# EAGLE schematic opencmpp (EAGLE 6.4)
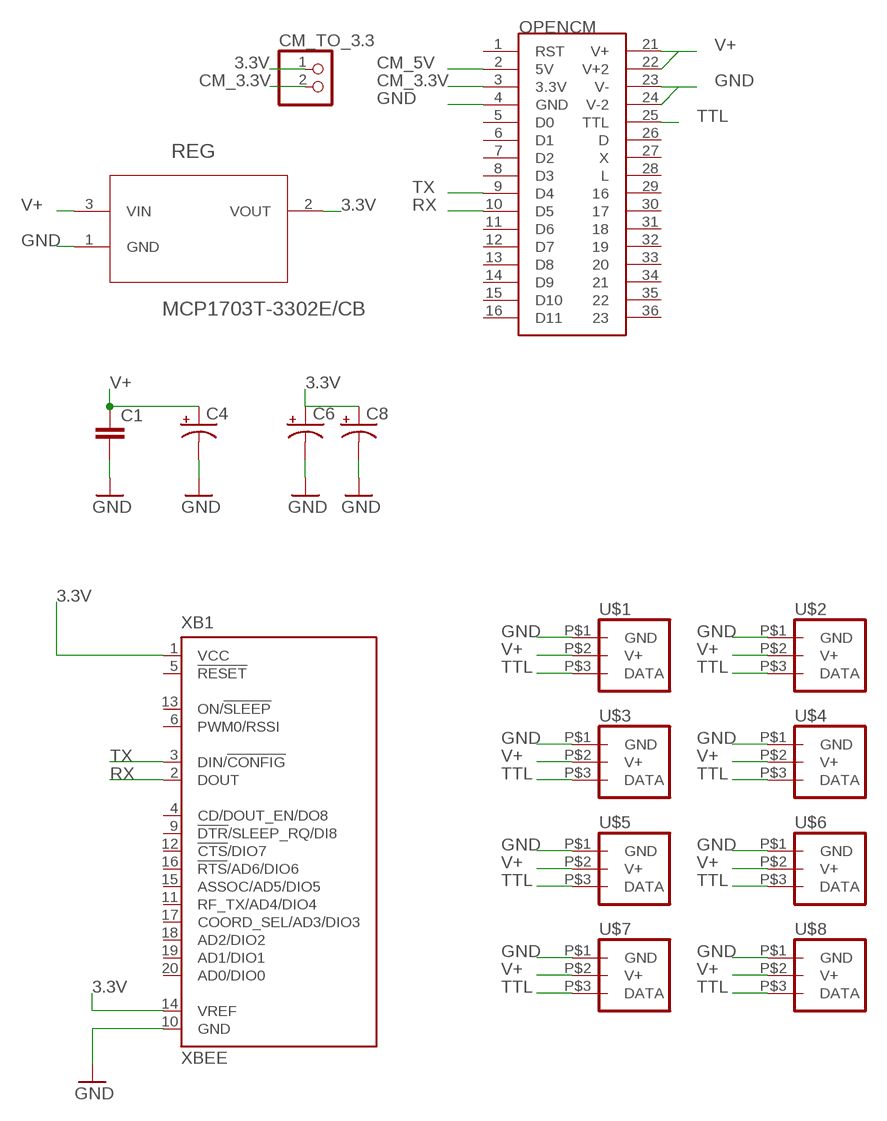
[diagram p0: schematic, sheet 1]

## Parts
C1  C-EU075-032X103  [C075-032X103]
C4  CAP_POLPTH2  [CPOL-RADIAL-10UF-25V]
C6  CAP_POLPTH2  [CPOL-RADIAL-10UF-25V]
C8  CAP_POLPTH2  [CPOL-RADIAL-10UF-25V]
CM_TO_3.3  CONNEC_1X02  [CONNEC_1X02]
OPENCM  OPENCM_REDUC  [OPENCM_REDUC]
REG  MCP1703T-3302E/CB  [SOT95P300X145-3N]
U$1  XL_320_CONNEC  [DXL_320_CONNEC]
U$2  XL_320_CONNEC  [DXL_320_CONNEC]
U$3  XL_320_CONNEC  [DXL_320_CONNEC]
U$4  XL_320_CONNEC  [DXL_320_CONNEC]
U$5  XL_320_CONNEC  [DXL_320_CONNEC]
U$6  XL_320_CONNEC  [DXL_320_CONNEC]
U$7  XL_320_CONNEC  [DXL_320_CONNEC]
U$8  XL_320_CONNEC  [DXL_320_CONNEC]
XB1  XBEE  [XBEE]

## Nets
3.3V: C6.1(+) C8.1(+) CM_TO_3.3.1 REG.2(VOUT) XB1.1(VCC) XB1.14(VREF)
CM_3.3V: CM_TO_3.3.2 OPENCM.3(3.3V)
CM_5V: OPENCM.2(5V)
GND [alime]: C1.2 C4.2(-) C6.2(-) C8.2(-) OPENCM.4(GND) OPENCM.23(V-) OPENCM.24(V-2) REG.1(GND) U$1.P$1(GND) U$2.P$1(GND) U$3.P$1(GND) U$4.P$1(GND) U$5.P$1(GND) U$6.P$1(GND) U$7.P$1(GND) U$8.P$1(GND) XB1.10(GND)
RX: OPENCM.10(D5) XB1.2(DOUT)
TTL: OPENCM.25(TTL) U$1.P$3(DATA) U$2.P$3(DATA) U$3.P$3(DATA) U$4.P$3(DATA) U$5.P$3(DATA) U$6.P$3(DATA) U$7.P$3(DATA) U$8.P$3(DATA)
TX: OPENCM.9(D4) XB1.3(DIN/!CONFIG)
V+ [alime]: C1.1 C4.1(+) OPENCM.21(V+) OPENCM.22(V+2) REG.3(VIN) U$1.P$2(V+) U$2.P$2(V+) U$3.P$2(V+) U$4.P$2(V+) U$5.P$2(V+) U$6.P$2(V+) U$7.P$2(V+) U$8.P$2(V+)
Unconnected: OPENCM.1(RST) OPENCM.5(D0) OPENCM.6(D1) OPENCM.7(D2) OPENCM.8(D3) OPENCM.11(D6) OPENCM.12(D7) OPENCM.13(D8) OPENCM.14(D9) OPENCM.15(D10) OPENCM.16(D11) OPENCM.26(D) OPENCM.27(X) OPENCM.28(L) OPENCM.29 OPENCM.30 OPENCM.31 OPENCM.32 OPENCM.33 OPENCM.34 OPENCM.35 OPENCM.36 XB1.4(CD/DOUT_EN/DO8) XB1.5(!RESET) XB1.6(PWM0/RSSI) XB1.9(!DTR!/SLEEP_RQ/DI8) XB1.11(RF_TX/AD4/DIO4) XB1.12(!CTS!/DIO7) XB1.13(ON/!SLEEP) XB1.15(ASSOC/AD5/DIO5) XB1.16(!RTS!/AD6/DIO6) XB1.17(COORD_SEL/AD3/DIO3) XB1.18(AD2/DIO2) XB1.19(AD1/DIO1) XB1.20(AD0/DIO0)

## Library data of the parts
C1 = rcl:C-EU: CAPACITOR, European symbol
C4 C6 C8 = SparkFun-Capacitors:CAP_POL: Capacitor Polarized These are standard SMD and PTH capacitors. Normally 10uF, 47uF, and 100uF in electrolytic and tantalum varieties. Always verify the external diameter of the through hole cap, it varies with capacity, voltage, and manufacturer. The EIA devices should be standard.
CM_TO_3.3 = RobotCampus:CONNEC_1X02
OPENCM = RobotCampus:OPENCM_REDUC
REG = RobotCampus:MCP1703T-3302E/CB: Low Quiescent Current LDO Regulator; MPN: MCP1703T-3302E/CB; OC_FARNELL: 1439518; OC_NEWARK: 40M0637; PACKAGE: SOT-3; SUPPLIER: Microchip
U$1-U$8 = RobotCampus:XL_320_CONNEC
XB1 = RobotCampus:XBEE: XBee (TM) /XBee-PRO(TM) OEM RF Modules Source: MaxStream, Inc. xbee_productmanual.pdf; MPN: XBP24-Z7UIT-004; OC_FARNELL: 1751799; OC_NEWARK: 34R5507

## Net classes
1 alime: width 0.508 mm